# EAGLE design oxvox (EAGLE 7.7.0)
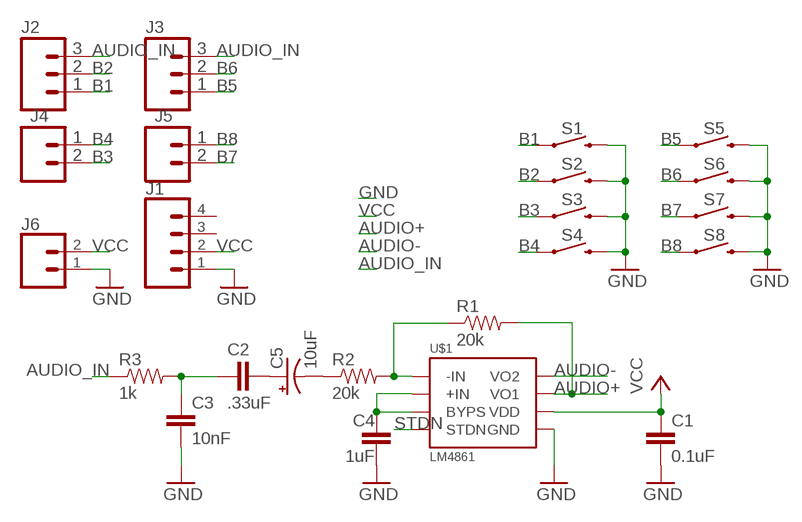
[diagram p0: schematic, sheet 1]

## Parts
C1  0.1uF  CAP0603-CAP  [0603-CAP]
C2  .33uF  CAP0603-CAP  [0603-CAP]
C3  10nF  CAP0603-CAP  [0603-CAP]
C4  1uF  CAP0603-CAP  [0603-CAP]
C5  10uF  RADIAL-CAP4MM  [RADIAL_SMT_4MM]
J1  CONN_04  [1X04]
J2  M03-PTH_LONG_NO_SILK_BOT  [M03_LONG_NO_SILK_BOTTOM]
J3  M03-PTH_LONG_NO_SILK_BOT  [M03_LONG_NO_SILK_BOTTOM]
J4  M02-PTH_LONG_NO_SILK_BOT  [M02_LONG_NO_SILK_BOTTOM]
J5  M02-PTH_LONG_NO_SILK_BOT  [M02_LONG_NO_SILK_BOTTOM]
J6  CONN_02  [1X02]
R1  20k  RESISTOR0805-RES  [0805]
R2  20k  RESISTOR0805-RES  [0805]
R3  1k  RESISTOR0603-RES  [0603-RES]
S1  MOMENTARY-SWITCH-SPST-PTH-6.0MM-KIT-ALL2  [TACTILE_SWITCH_PTH_6.0MM_KIT_NOSILK]
S2  MOMENTARY-SWITCH-SPST-PTH-6.0MM-KIT-ALL2  [TACTILE_SWITCH_PTH_6.0MM_KIT_NOSILK]
S3  MOMENTARY-SWITCH-SPST-PTH-6.0MM-KIT-ALL2  [TACTILE_SWITCH_PTH_6.0MM_KIT_NOSILK]
S4  MOMENTARY-SWITCH-SPST-PTH-6.0MM-KIT-ALL2  [TACTILE_SWITCH_PTH_6.0MM_KIT_NOSILK]
S5  MOMENTARY-SWITCH-SPST-PTH-6.0MM-KIT-ALL2  [TACTILE_SWITCH_PTH_6.0MM_KIT_NOSILK]
S6  MOMENTARY-SWITCH-SPST-PTH-6.0MM-KIT-ALL2  [TACTILE_SWITCH_PTH_6.0MM_KIT_NOSILK]
S7  MOMENTARY-SWITCH-SPST-PTH-6.0MM-KIT-ALL2  [TACTILE_SWITCH_PTH_6.0MM_KIT_NOSILK]
S8  MOMENTARY-SWITCH-SPST-PTH-6.0MM-KIT-ALL2  [TACTILE_SWITCH_PTH_6.0MM_KIT_NOSILK]
U$1  LM4861  [8-SOIC]

## Nets
AUDIO+: R1.2 U$1.P$5(VO1)
AUDIO-: U$1.P$8(VO2)
AUDIO_IN: J2.P$3 J3.P$3 R3.1
B1: J2.P$1 S1.1 S1.2
B2: J2.P$2 S2.1 S2.2
B3: J4.P$2 S3.1 S3.2
B4: J4.P$1 S4.1 S4.2
B5: J3.P$1 S5.1 S5.2
B6: J3.P$2 S6.1 S6.2
B7: J5.P$2 S7.1 S7.2
B8: J5.P$1 S8.1 S8.2
GND: C1.2 C3.2 C4.2 J1.1 J6.1 S1.3 S1.4 S2.3 S2.4 S3.3 S3.4 S4.3 S4.4 S5.3 S5.4 S6.3 S6.4 S7.3 S7.4 S8.3 S8.4 U$1.P$7(GND)
N$2: R1.1 R2.2 U$1.P$4(-IN)
N$3: C2.2 C3.1 R3.2
N$4: C5.P$2(-) R2.1
N$5: C4.1 U$1.P$2(BYPS) U$1.P$3(+IN)
N$7: C2.1 C5.P$1(+)
STDN: U$1.P$1(STDN)
VCC: C1.1 J1.2 J6.2 U$1.P$6(VDD)
Unconnected: J1.3 J1.4

## Library data of the parts
C1-C4 = SparkFun-Passives:CAP: Capacitor Standard 0603 ceramic capacitor, and 0.1" leaded capacitor.
C5 = IDEO-Capacitors:RADIAL-CAP
J1 = SparkFun-Connectors:CONN_04: Multi connection point. Often used as Generic Header-pin footprint for 0.1 inch spaced/style header connections On any of the 0.1 inch spaced packages, you can populate with these: Break Away Headers - Straight <https://www.sparkfun.com/products/116> (PRT-00116) Break Away Male Headers - Right Angle <https://www.sparkfun.com/products/553> (PRT-00553) Female Headers <https://www.sparkfun.com/products/115> (PRT-00115) Break Away Headers - Machine Pin <https://www.sparkfun.com/products/117> (PRT-00117) Break Away Female Headers - Swiss Machine Pin <https://www.sparkfun.com/products/743> (PRT-00743) For SCREWTERMINALS and SPRING TERMINALS visit here: Screw Terimnals on SparkFun.com <https://www.sparkfun.com/search/results?term=Screw+Terminals> (5mm/3.5mm/2.54mm spacing) This device is also useful as a general connection point to wire up your design to another part of your project. Our various solder wires solder well into these plated through hole pads. Hook-Up Wire - Assortment (Stranded, 22 AWG) <https://www.sparkfun.com/products/11375> (PRT-11375) Hook-Up Wire - Assortment (Solid Core, 22 AWG) <https://www.sparkfun.com/products/11367> (PRT-11367) View the entire wire category on our website here <https://www.sparkfun.com/categories/141> Special notes: Molex polarized connector foot print use with SKU : PRT-08231 with associated crimp pins and housings. 1MM SMD Version SKU: PRT-10208; PROD_ID: CONN-09696
J2 J3 = IDEO-Connectors:M03
J4 J5 = IDEO-Connectors:M02
J6 = SparkFun-Connectors:CONN_02: Multi connection point. Often used as Generic Header-pin footprint for 0.1 inch spaced/style header connections On any of the 0.1 inch spaced packages, you can populate with these: Break Away Headers - Straight <https://www.sparkfun.com/products/116> (PRT-00116) Break Away Male Headers - Right Angle <https://www.sparkfun.com/products/553> (PRT-00553) Female Headers <https://www.sparkfun.com/products/115> (PRT-00115) Break Away Headers - Machine Pin <https://www.sparkfun.com/products/117> (PRT-00117) Break Away Female Headers - Swiss Machine Pin <https://www.sparkfun.com/products/743> (PRT-00743) For SCREWTERMINALS and SPRING TERMINALS visit here: Screw Terimnals on SparkFun.com <https://www.sparkfun.com/search/results?term=Screw+Terminals> (5mm/3.5mm/2.54mm spacing) This device is also useful as a general connection point to wire up your design to another part of your project. Our various solder wires solder well into these plated through hole pads. Hook-Up Wire - Assortment (Stranded, 22 AWG) <https://www.sparkfun.com/products/11375> (PRT-11375) Hook-Up Wire - Assortment (Solid Core, 22 AWG) <https://www.sparkfun.com/products/11367> (PRT-11367) View the entire wire category on our website here <https://www.sparkfun.com/categories/141> Special notes: Molex polarized connector foot print use with: PRT-08233 with associated crimp pins and housings. 2.54_SCREWTERM for use with PRT-10571. 3.5mm Screw Terminal footprints for PRT-08084 5mm Screw Terminal footprints for use with PRT-08432
R1-R3 = SparkFun-Passives:RESISTOR: Resistor Basic schematic elements and footprints for 0603, 1206, and PTH resistors.
S1-S8 = SparkFun-Switches:MOMENTARY-SWITCH-SPST: Momentary Switch (Pushbutton) - SPST Normally-open (NO) SPST momentary switches (buttons, pushbuttons). Variants PTH-12MM - 12mm square, through-hole Momentary Pushbutton Switch - 12mm Square <https://www.sparkfun.com/products/9190> (COM-09190) PTH-6.0MM, PTH-6.0MM-KIT - 6.0mm square, through-hole Mini Pushbutton Switch <https://www.sparkfun.com/products/97> (COM-00097) KIT package intended for soldering kit's - only one side of pads' copper is exposed. PTH-RIGHT-ANGLE-KIT - Right-angle, through-hole Right Angle Tactile Button <https://www.sparkfun.com/products/10791> - Used on SparkFun BigTime Watch Kit <https://www.sparkfun.com/products/11734> SMD-12MM - 12mm square, surface-mount Tactile Button - SMD (12mm) <https://www.sparkfun.com/products/12993> (COM-12993) Used on SparkFun PicoBoard <https://www.sparkfun.com/products/11888> SMD-4.5MM - 4.5mm Square Trackball Switch Used on SparkFun Blackberry Trackballer Breakout <https://www.sparkfun.com/products/13169> SMD-4.6MMX2.8MM - 4.60mm x 2.80mm, surface mount Used on SparkFun SAMD21 Mini Breakout <https://www.sparkfun.com/products/13664> SMD-5.2MM, SMD-5.2-REDUNDANT - 5.2mm square, surface-mount Mini Pushbutton Switch - SMD <https://www.sparkfun.com/products/8720> (COM-08720) Used on Arduino Pro Mini <https://www.sparkfun.com/products/11114> REDUNDANT package connects both switch circuits together SMD-6.0X3.5MM - 6.0 x 3.5mm, surface mount Momentary Reset Switch SMD <https://www.sparkfun.com/products/8229> (COM-08229) SMD-6.2MM-TALL - 6.2mm square, surface mount Tactile Button - SMD (6mm) <https://www.sparkfun.com/products/12992> Used on SparkFun Digital Sandbox <https://www.sparkfun.com/products/12651> SMD-RIGHT-ANGLE - Right-angle, surface mount Used on SparkFun Block for Intel® Edison - Arduino <https://www.sparkfun.com/products/13036>
U$1 = IDEO-ICs:LM4861

## Board
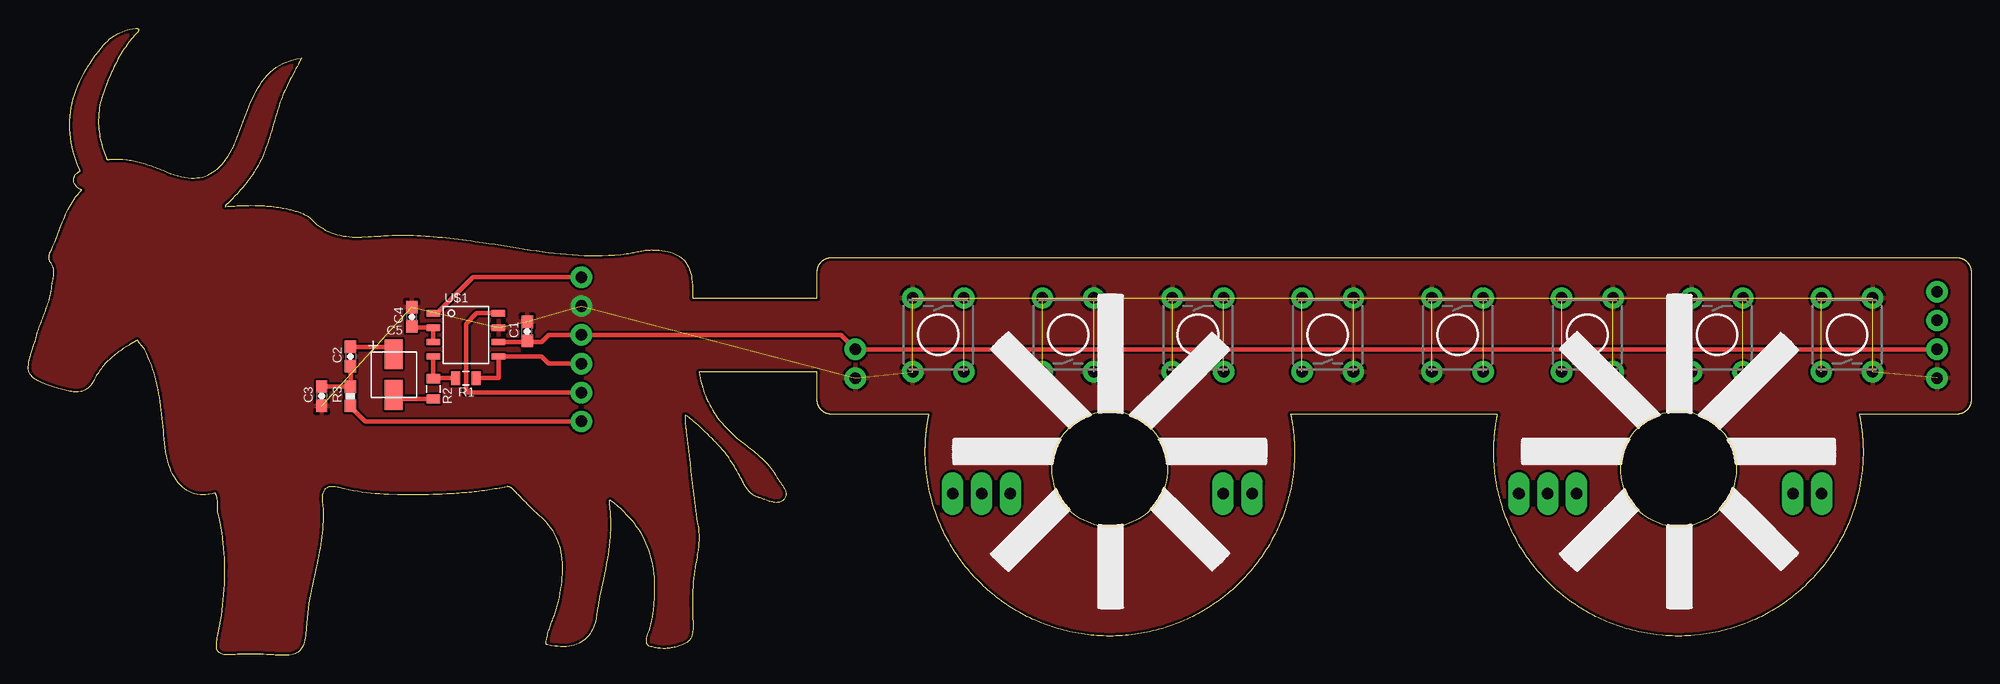
[diagram p1: board, top side]
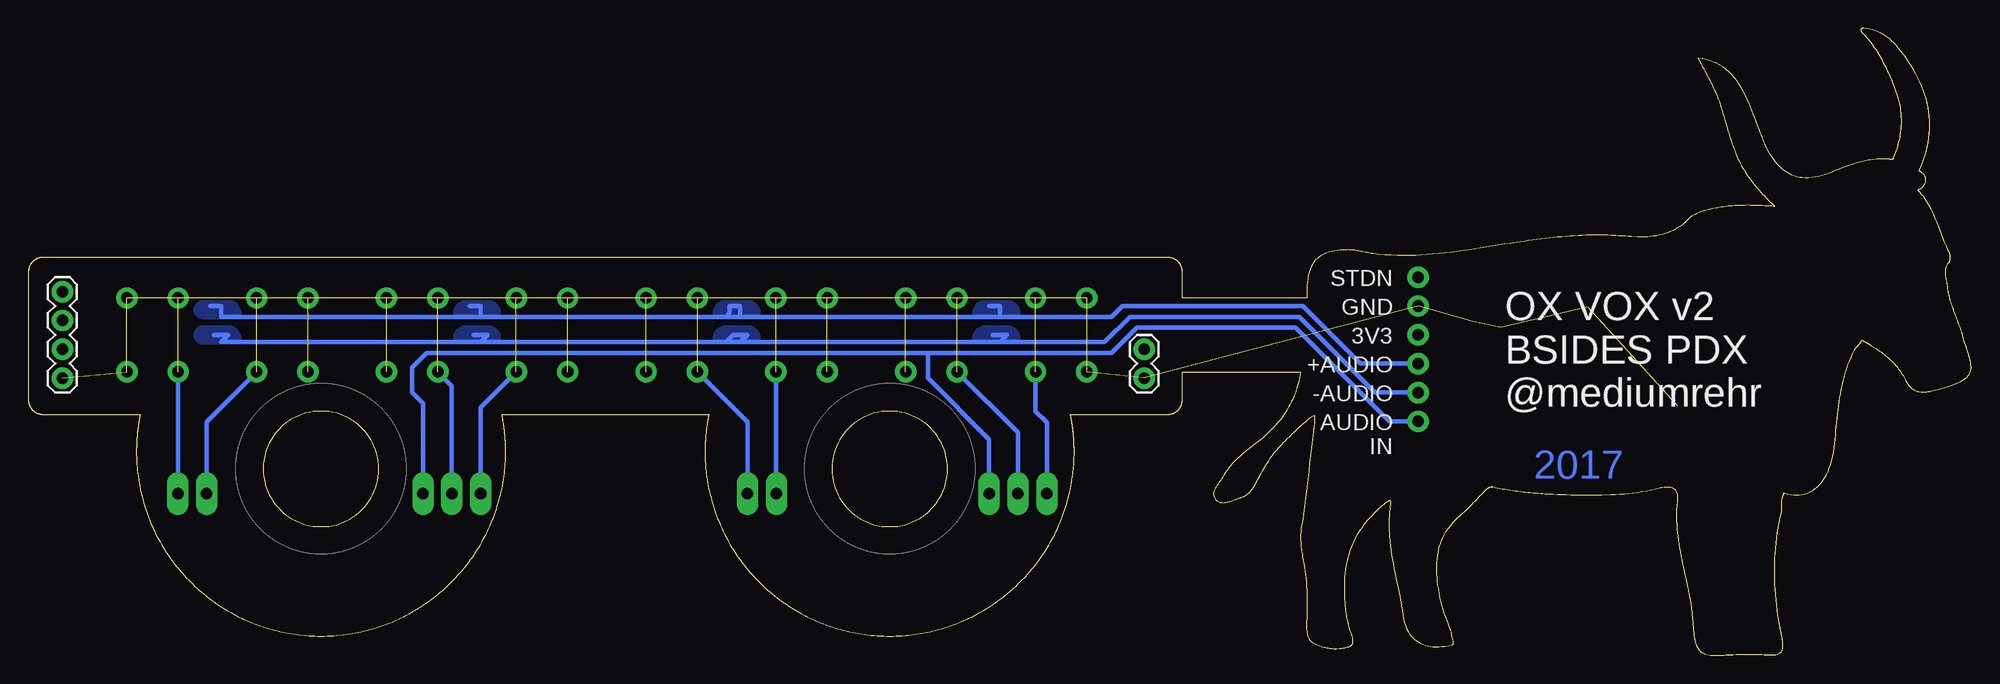
[diagram p2: board, bottom side, seen from below]

Size 171.05 x 55.23 mm. Coordinates in mm from the lower left corner, seen from the top.
Outline: 2815 segments
Copper layers (1*16): Top 0.035mm / dielectric 1.5mm / Bottom 0.035mm
Design rules "SparkFun": minimum track width 8mil, minimum drill 20mil, track to track 8mil, track to pad 8mil, pad to pad 8mil, via to via 8mil, smd to smd 8mil, copper to edge 10mil, drill to drill 8mil, minimum pad ring 12mil, minimum via ring 10mil, stop-mask expansion 4mil, vias tented up to drill 25mil, thermal gap 10mil

### Footprints (pad centres in the part's own frame; a part is rotated, then mirrored left to right if it is on the bottom)
0603-CAP = smd 1.1 x 1: 1 -0.85,0; 2 0.85,0
RADIAL_SMT_4MM = smd 1.6 x 2.6: P$1 0,-1.8; P$2 0,1.8
1X04 = drill 1.016 pad 1.88: 1 0,0; 2 2.54,0; 3 5.08,0; 4 7.62,0
M03_LONG_NO_SILK_BOTTOM = drill 1.016 pad 1.88 long: P$1 0,2.54; P$2 0,0; P$3 0,-2.54
M02_LONG_NO_SILK_BOTTOM = drill 1.016 pad 1.88 long: P$1 0,1.27; P$2 0,-1.27
1X02 = drill 1.016 pad 1.88: 1 0,0; 2 2.54,0
0805 = smd 0.8 x 1.2: 1 -0.9,0; 2 0.9,0
0603-RES = smd 1.1 x 1: 1 -0.85,0; 2 0.85,0
TACTILE_SWITCH_PTH_6.0MM_KIT_NOSILK = drill 1.016 pad 1.88: 1 -3.251,2.261; 2 3.251,2.261; 3 -3.251,-2.261; 4 3.251,-2.261
8-SOIC = smd 0.55 x 1.2: P$1 -1.905,-2.87; P$2 -0.635,-2.87; P$3 0.635,-2.87; P$4 1.905,-2.87; P$5 1.905,2.87; P$6 0.635,2.87; P$7 -0.635,2.87; P$8 -1.905,2.87

### Placement (x,y rotation side)
C1  43.92,28.55 90 top
C2  28.36,26.33 270 top
C3  25.82,22.83 270 top
C4  33.76,29.82 90 top
C5  32.17,24.74 180 top
J1  168.06,24.42 90 bottom
J2  83.92,14.26 270 bottom
J3  133.77,14.26 270 bottom
J4  106.47,14.26 90 bottom
J5  156.63,14.26 90 bottom
J6  72.81,24.42 90 bottom
R1  38.52,24.42 0 top
R2  35.66,23.47 90 top
R3  28.36,22.83 90 top
S1  80.11,28.23 270 top
S2  91.54,28.23 90 top
S3  102.97,28.23 270 top
S4  114.4,28.23 90 top
S5  125.83,28.23 270 top
S6  137.26,28.23 90 top
S7  148.69,28.23 270 top
S8  160.12,28.23 90 top
U$1  38.52,28.23 270 top

### Tracks (layer width: path | path; a pad name or v marks a point on that pad's centre or on a via)
AUDIO+  (via drill 1.02 pad 1.88)
  Top 0.406: R1.2 41.39,24.42 U$1.P$5 45.19,26.33 45.82,25.69 v48.68,25.69
  Bottom 0.406: 131.23,29.82 154.09,29.82 154.09,30.77 155.04,30.77 | 131.23,29.82 109.64,29.82 | 109.64,29.82 85.51,29.82 | 85.51,29.82 75.67,29.82 74.72,30.77 58.84,30.77 53.76,25.69 v48.68,25.69 | 86.46,30.77 85.51,30.77 85.51,29.82 | 132.18,30.77 131.23,30.77 131.23,29.82 | 108.37,29.82 108.37,30.77 109.32,30.77 109.32,30.14 109.64,29.82
  pour Bottom: 83.92,29.82 83.92,30.14 arc-90 84.88,31.09 86.78,31.09 arc-90 87.73,30.14 87.73,29.82
  pour Bottom: 129.64,29.82 129.64,30.14 arc-90 130.6,31.09 132.5,31.09 arc-90 133.45,30.14 133.45,29.82
  pour Bottom: 106.78,29.82 106.78,30.14 arc-90 107.74,31.09 109.64,31.09 arc-90 110.59,30.14 110.59,29.82
  pour Bottom: 152.5,29.82 152.5,30.14 arc-90 153.46,31.09 155.68,31.09 arc-90 156.31,30.45 arc-90 155.68,29.82 155.36,29.82
AUDIO-  (via drill 1.02 pad 1.88)
  Top 0.406: U$1.P$8 39.47,30.14 38.52,29.19 38.52,23.15 v48.68,23.15
  Bottom 0.406: 131.23,27.6 154.09,27.6 153.46,28.23 154.73,28.23 | 131.23,27.6 109.64,27.6 | 109.64,27.6 85.51,27.6 | 85.51,27.6 76.3,27.6 74.08,29.82 59.16,29.82 52.49,23.15 v48.68,23.15 | 86.15,28.23 84.88,28.23 85.51,27.6 | 108.37,27.6 107.74,28.23 109.01,28.23 109.64,27.6 | 131.87,28.23 130.6,28.23 131.23,27.6
  pour Bottom: 83.92,27.6 83.92,27.91 arc-90 84.88,28.87 86.78,28.87 arc-90 87.73,27.91 87.73,27.6
  pour Bottom: 129.64,27.6 129.64,27.91 arc-90 130.6,28.87 132.5,28.87 arc-90 133.45,27.91 133.45,27.6
  pour Bottom: 106.78,27.6 106.78,27.91 arc-90 107.74,28.87 109.64,28.87 arc-90 110.59,27.91 110.59,27.6
  pour Bottom: 152.5,27.6 152.5,27.91 arc-90 153.46,28.87 155.68,28.87 arc-90 156.31,28.23 arc-90 155.68,27.6
AUDIO_IN  (via drill 1.02 pad 1.88)
  Top 0.406: R3.1 28.36,21.88 29.63,20.61 v48.68,20.61
  Bottom 0.406: 91.86,26.64 135.99,26.64 137.26,25.37 137.26,23.15 136.31,22.2 J3.P$3 | 91.86,26.64 91.86,24.42 86.46,19.02 J2.P$3 | 91.86,26.64 75.67,26.64 73.45,28.87 59.48,28.87 51.22,20.61 v48.68,20.61
B1  (1 unrouted)
  Bottom 0.406: S1.2 82.37,21.49 81.38,20.5 J2.P$1
B2  (1 unrouted)
  Bottom 0.406: S2.1 83.92,19.62 J2.P$2
B3  (1 unrouted)
  Bottom 0.406: S3.2 105.23,14.3 J4.P$2
B4  (1 unrouted)
  Bottom 0.406: S4.1 107.74,20.57 J4.P$1
B5  (1 unrouted)
  Bottom 0.406: S5.2 131.23,21.84 J3.P$1
B6  (1 unrouted)
  Bottom 0.406: S6.1 133.77,23.75 J3.P$2
B7  (1 unrouted)
  Bottom 0.406: S7.2 155.36,20.57 J5.P$2
B8  (1 unrouted)
  Bottom 0.406: S8.1 157.86,14.3 J5.P$1
GND  (via drill 1.02 pad 1.88)  (22 unrouted)
  other vias: 48.68,30.77
  pour Top: 11.85,57.44 4.23,56.17 1.69,43.47 -0.85,23.15 5.5,21.88 9.31,25.69 13.12,12.99 15.66,12.99 15.66,-0.98 25.82,-0.98 27.09,12.99 42.33,12.99 46.14,7.91 44.87,0.29 60.11,0.29 60.11,16.8 65.19,11.72 67.73,11.72 67.73,16.8 60.11,23.15 67.73,23.15 69,19.34 77.89,19.34 79.16,9.18 89.32,0.29 103.29,0.29 112.18,10.45 112.18,20.61 127.42,20.61 127.42,10.45 138.85,1.56 156.63,1.56 162.98,10.45 162.98,20.61 173.14,20.61 173.14,35.85 48.68,35.85 20.74,40.93 25.82,53.63 22.01,53.63 14.39,43.47 8.04,44.74 8.04,49.82
N$2
  Top 0.406: R1.1 35.98,24.42 | 35.98,24.42 35.65,24.42 U$1.P$4 | R2.2 35.93,24.37 35.98,24.42
N$3
  Top 0.406: C3.1 R3.2 C2.2
N$4
  Top 0.406: R2.1 32.54,22.57 32.17,22.84 C5.P$2
N$5
  Top 0.406: U$1.P$3 U$1.P$2 33.54,28.87 C4.1
N$7
  Top 0.406: C2.1 31.96,27.18 32.17,26.96 C5.P$1
STDN  (via drill 1.02 pad 1.88)
  Top 0.406: U$1.P$1 35.98,30.14 39.16,33.31 v48.68,33.31
VCC  (via drill 1.02 pad 1.88)
  Top 0.406: U$1.P$6 43.39,27.6 C1.1 43.6,27.6 45.19,27.6 45.82,28.23 v48.68,28.23 71.54,28.23 J6.2 J1.2

### Text on the board
Bottom: 2017
bPlace: STDN | GND | 3V3 | +AUDIO | -AUDIO | OX VOX v2 / BSIDES PDX / @mediumrehr | AUDIO / IN